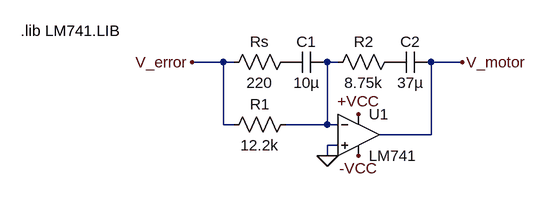
[diagram p0: schematic Draft1.asc]
Draft1.asc, the LTspice schematic file:
Version 4
SHEET 1 880 680
WIRE 304 96 256 96
WIRE 320 96 304 96
WIRE 480 96 464 96
WIRE 672 96 624 96
WIRE 304 192 304 96
WIRE 320 192 304 192
WIRE 464 192 464 96
WIRE 464 192 400 192
WIRE 480 192 464 192
WIRE 624 208 624 96
WIRE 624 208 544 208
WIRE 480 224 464 224
WIRE 464 240 464 224
FLAG 464 240 0
FLAG 256 96 V_error
FLAG 672 96 V_motor
FLAG 512 176 +VCC
FLAG 512 240 -VCC
SYMBOL res 416 176 R90
WINDOW 0 0 56 VBottom 2
WINDOW 3 32 56 VTop 2
SYMATTR InstName R1
SYMATTR Value 12.2k
SYMBOL res 576 80 R90
WINDOW 0 0 56 VBottom 2
WINDOW 3 32 56 VTop 2
SYMATTR InstName R2
SYMATTR Value 8.75k
SYMBOL res 416 80 R90
WINDOW 0 0 56 VBottom 2
WINDOW 3 32 56 VTop 2
SYMATTR InstName Rs
SYMATTR Value 220
SYMBOL cap 464 80 R90
WINDOW 0 0 32 VBottom 2
WINDOW 3 32 32 VTop 2
SYMATTR InstName C1
SYMATTR Value 10µ
SYMBOL cap 624 80 R90
WINDOW 0 0 32 VBottom 2
WINDOW 3 32 32 VTop 2
SYMATTR InstName C2
SYMATTR Value 37µ
SYMBOL OpAmps\\LM741 512 144 R0
SYMATTR InstName U1
TEXT -8 48 Left 2 !.lib LM741.LIB

The netlist it stands for:
* Draft1.asc
R1 N001 V_error 12.2k
R2 P001 N001 8.75k
Rs P002 V_error 220
C1 N001 P002 10µ
C2 V_motor P001 37µ
XU1 0 N001 +VCC -VCC V_motor LM741  ; pins In+ In- V+ V- OUT
.lib LM741.LIB
.lib LM741.lib
.backanno
.end